# EasyEDA schematic Smart_Tiestu_v4.json
TITLE: Smart Tiestu; REV: 1.0; Date: 2025-11-11; Sheet: 1/1; Drawn By: Diego López; Company: Universidad de Oviedo
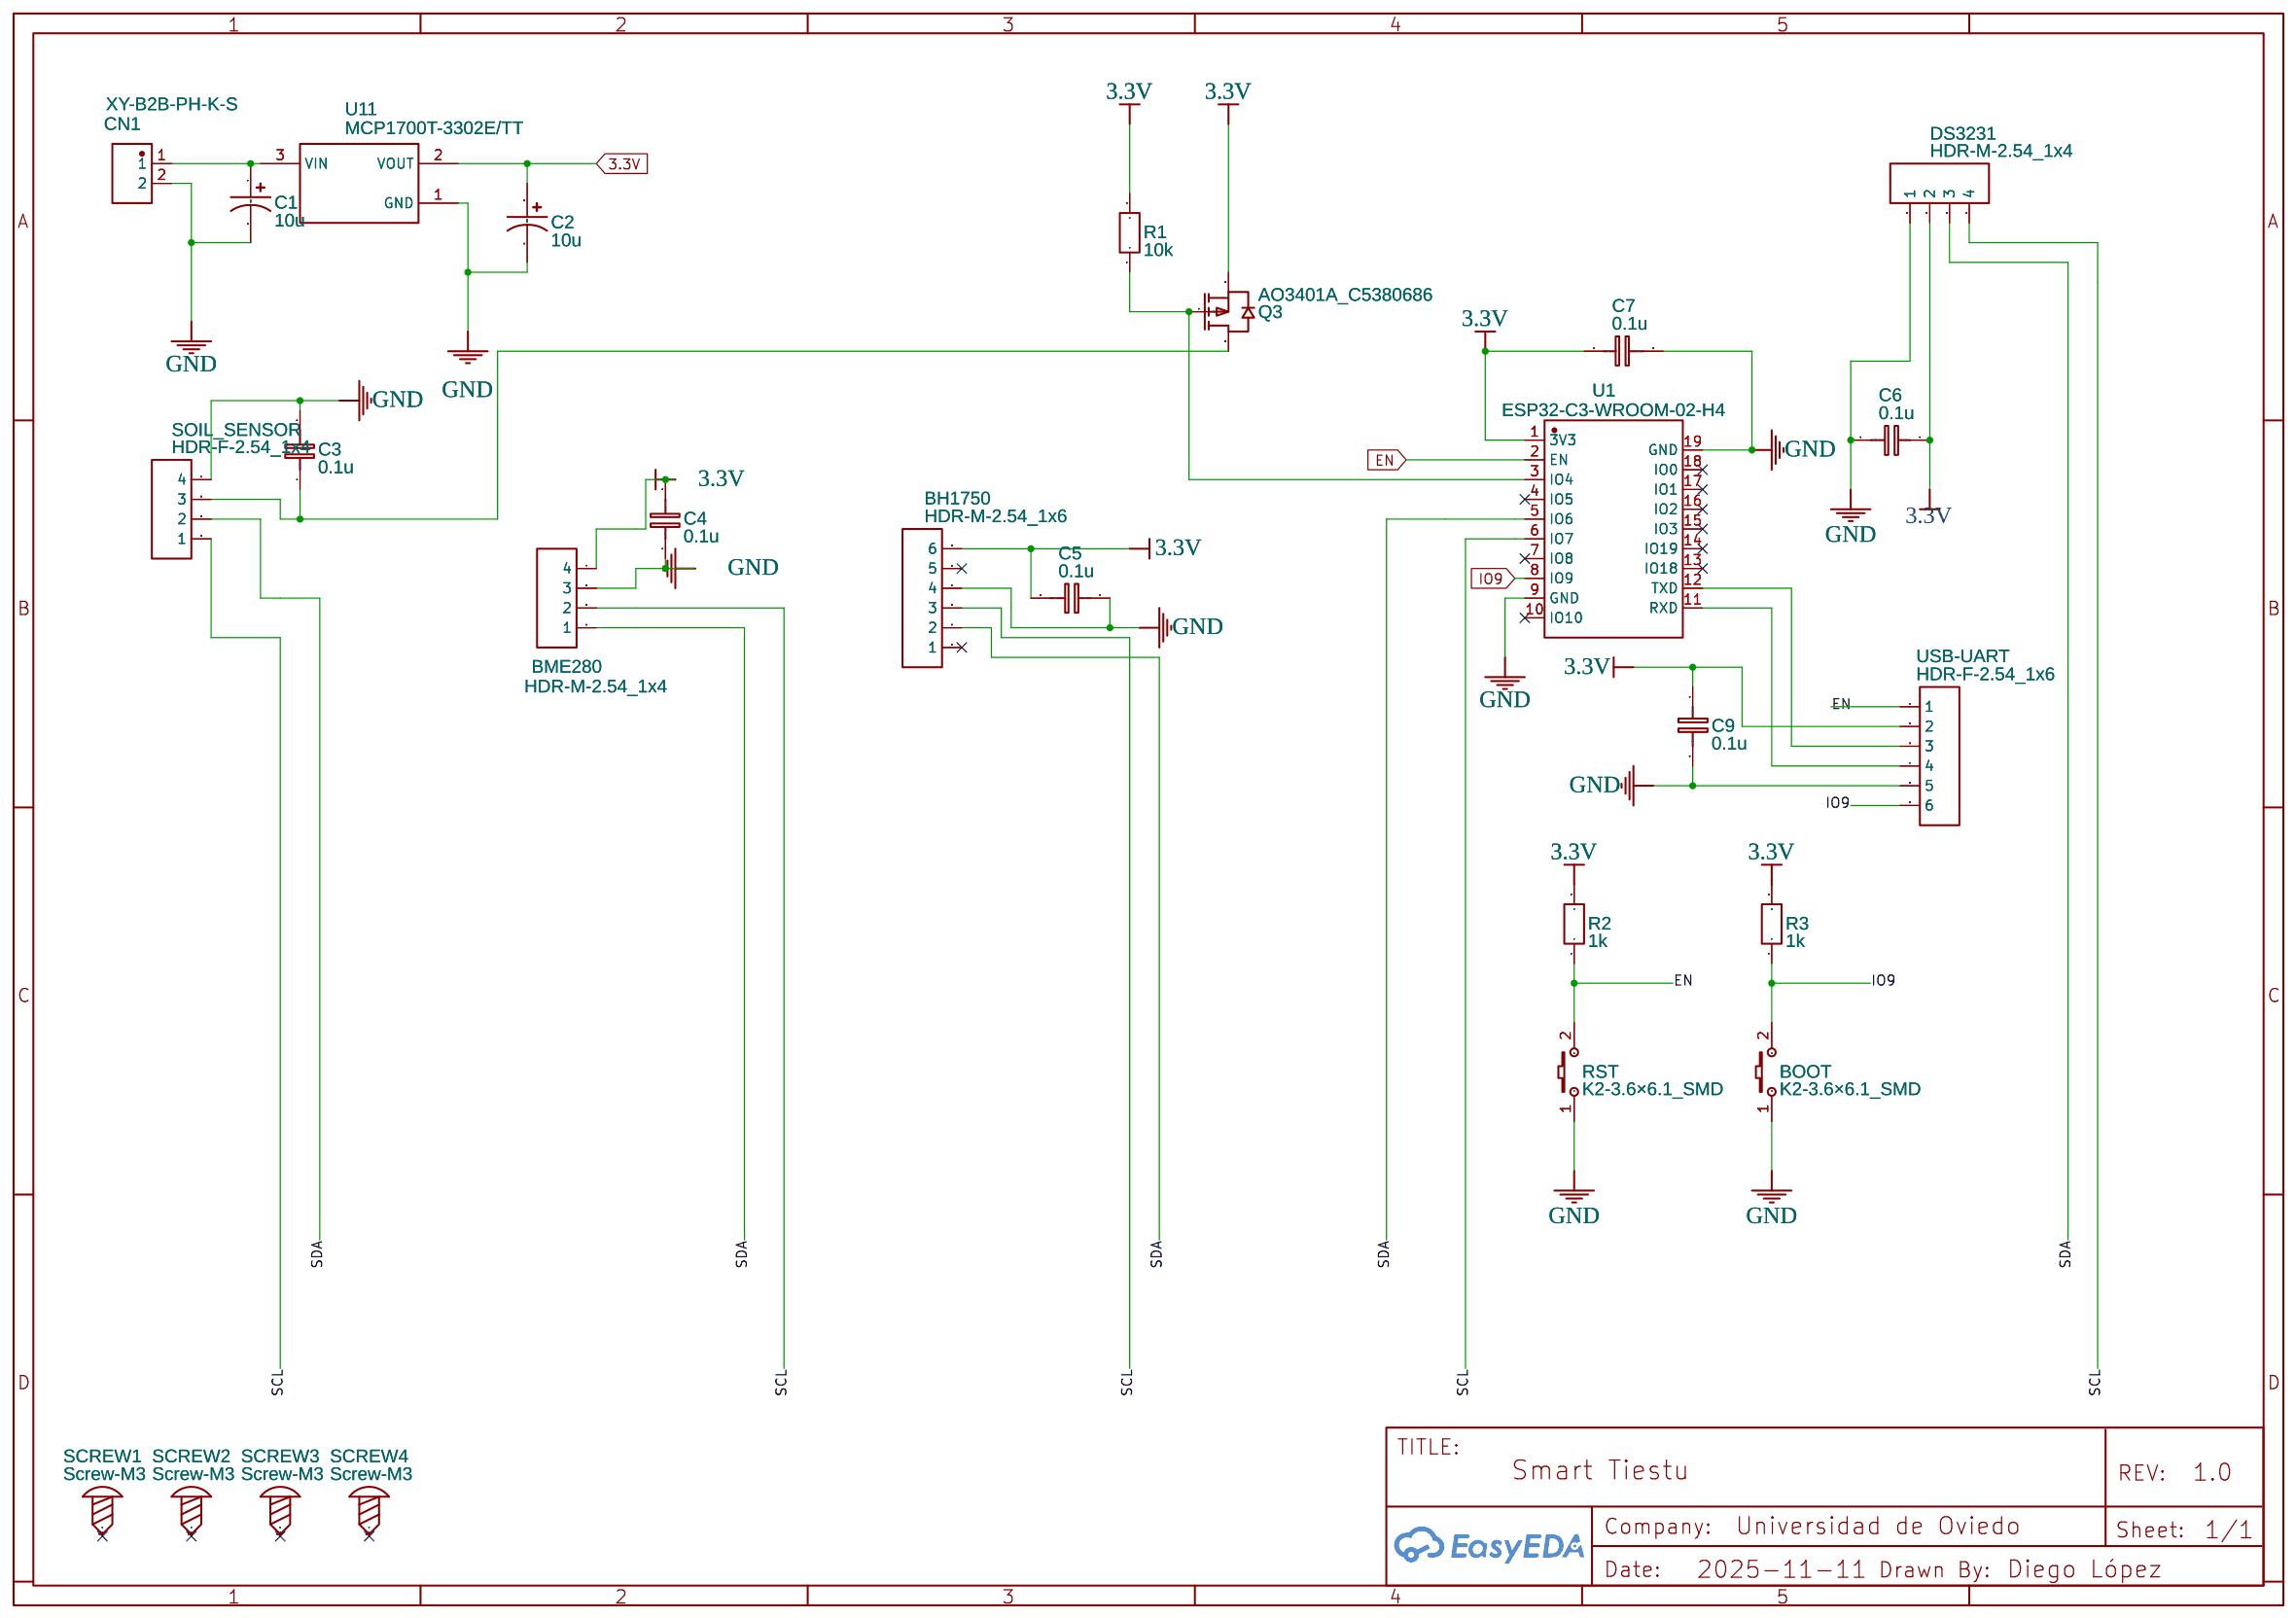
[diagram p0: schematic sheet]

## Parts
BH1750  HDR-M-2.54_1x6  [HDR-M-2.54_1X6]
BME280  HDR-M-2.54_1x4  [HDR-M-2.54_1X4]
BOOT  K2-3.6×6.1_SMD  [KEY-SMD_2P-L6.2-W3.6-LS8.0]
C1  10u  [CAP-D5.0-H5.5]
C2  10u  [CAP-D5.0-H5.5]
C3  0.1u  [C0805]
C4  0.1u  [C0805]
C5  0.1u  [C0805]
C6  0.1u  [C0805]
C7  0.1u  [C0805]
C9  0.1u  [C0805]
CN1  XY-B2B-PH-K-S  [CONN-TH_B2B-PH-K-S]
DS3231  HDR-M-2.54_1x4  [HDR-M-2.54_1X4]
Q3  AO3401A_C5380686  [SOT-23-3_L2.9-W1.3-P1.90-LS2.4-BR]
R1  10k  [R0603]
R2  1k  [R0603]
R3  1k  [R0603]
RST  K2-3.6×6.1_SMD  [KEY-SMD_2P-L6.2-W3.6-LS8.0]
SCREW1  Screw-M3  [SCREW-M3]
SCREW2  Screw-M3  [SCREW-M3]
SCREW3  Screw-M3  [SCREW-M3]
SCREW4  Screw-M3  [SCREW-M3]
SOIL_SENSOR  HDR-F-2.54_1x4  [HDR-F-2.54_1X4]
U1  ESP32-C3-WROOM-02-H4  [WIFIM-SMD_18P-L20.0-W18.0-P1.50]
U11  MCP1700T-3302E/TT  [SOT-23-3_L2.9-W1.6-P1.90-LS2.8-BR]
USB-UART  HDR-F-2.54_1x6  [HDR-F-2.54_1X6]

## Library data of the parts
BH1750 = HDR-M-2.54_1x6: Supplier Part: C190819; Supplier: LCSC; Contributor: LCEDA_Lib
BME280 DS3231 = HDR-M-2.54_1x4: Supplier Part: C124378; Supplier: LCSC; Contributor: LCEDA_Lib
BOOT RST = K2-3.6×6.1_SMD: Supplier Part: C118141; Supplier: LCSC; Manufacturer Part: K2-1107ST-A4SW-06; Contributor: LCEDA_Lib; 制造商: 韩国韩荣
C1 C2 = C_Tan_SMD_A_US: Contributor: LCEDA_Lib
C3-C7 C9 = C_0805_EU: Contributor: LCEDA_Lib
CN1 = XY-B2B-PH-K-S: Supplier: LCSC; Supplier Part: C51940125; Manufacturer: XYECONN(辛译); JLCPCB Part Class: Extended Part; Contributor: lcsc
Q3 = AO3401A_C5380686: Contributor: lcsc; Supplier: LCSC; Supplier Part: C5380686; Manufacturer: FUXINSEMI(富芯森美); Manufacturer Part: AO3401A; JLCPCB Part Class: Extended Part
R1-R3 = R_0603_EU: Contributor: LCEDA_Lib
SCREW1-SCREW4 = Screw-M3: Contributor: EasyEDA
SOIL_SENSOR = HDR-F-2.54_1x4: Supplier Part: C225501; Supplier: LCSC; Contributor: LCEDA_Lib
U1 = ESP32-C3-WROOM-02-H4: Contributor: LCSC; Supplier: LCSC; Supplier Part: C2944070; Manufacturer: ESPRESSIF(乐鑫); JLCPCB Part Class: Extended Part
U11 = MCP1700T-3302E/TT: Supplier: LCSC; Manufacturer: MICROCHIP(美国微芯); Supplier Part: C39051; JLCPCB Part Class: Extended Part
USB-UART = HDR-F-2.54_1x6: Supplier Part: C40877; Supplier: LCSC; Contributor: LCEDA_Lib

## Nets
3.3V: BH1750.6 BME280.4 C2.1 C4.2 C5.2 C6.1 C7.1 C9.1 DS3231.2 Q3.2(S) R1.2 R2.2 R3.2 U1.1(3V3) U11.2(VOUT) USB-UART.2
GND: BH1750.4 BME280.3 BOOT.1 C1.2 C2.2 C3.2 C4.1 C5.1 C6.2 C7.2 C9.2 CN1.2 DS3231.1 RST.1 SOIL_SENSOR.4 U1.9(GND) U1.19(GND) U11.1(GND) USB-UART.5
EN: R2.1 RST.2 U1.2(EN) USB-UART.1
IO9: BOOT.2 R3.1 U1.8(IO9) USB-UART.6
SCL: BH1750.3 BME280.2 DS3231.4 SOIL_SENSOR.1 U1.6(IO7)
SDA: BH1750.2 BME280.1 DS3231.3 SOIL_SENSOR.2 U1.5(IO6)
Net-(C1-1): C1.1 CN1.1 U11.3(VIN)
Net-(C3-1): C3.1 Q3.3(D) SOIL_SENSOR.3
Net-(Q3-1): Q3.1(G) R1.1 U1.3(IO4)
Net-(U1-11): U1.11(RXD) USB-UART.4
Net-(U1-12): U1.12(TXD) USB-UART.3

Not connected (* = marked no-connect by the designer): BH1750 1* 5*; SCREW1 1*; SCREW2 1*; SCREW3 1*; SCREW4 1*; U1 4(IO5)* 7(IO8)* 10(IO10)* 13(IO18)* 14(IO19)* 15(IO3)* 16(IO2)* 17(IO1)* 18(IO0)*
